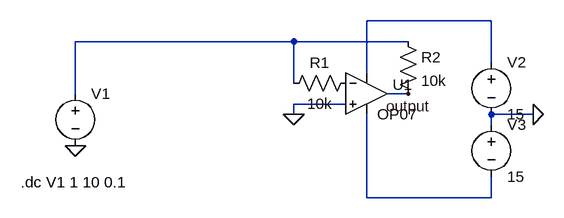
[diagram p0: schematic Draft01.asc]
Draft01.asc, the LTspice schematic file:
Version 4
SHEET 1 880 680
WIRE 608 -16 416 -16
WIRE 304 16 -32 16
WIRE 480 16 304 16
WIRE 608 48 608 -16
WIRE 416 64 416 -16
WIRE 304 80 304 16
WIRE -32 96 -32 16
WIRE 480 96 448 96
WIRE 384 112 304 112
WIRE 304 128 304 112
WIRE 672 128 608 128
WIRE 608 144 608 128
WIRE 416 256 416 128
WIRE 608 256 608 224
WIRE 608 256 416 256
FLAG -32 176 0
FLAG 672 128 0
FLAG 480 96 output
FLAG 304 128 0
SYMBOL voltage -32 80 R0
WINDOW 123 0 0 Left 0
WINDOW 39 0 0 Left 0
SYMATTR InstName V1
SYMATTR Value ""
SYMBOL OpAmps\\OP07 416 32 R0
WINDOW 0 40 50 Left 2
SYMATTR InstName U1
SYMBOL voltage 608 32 R0
WINDOW 123 0 0 Left 0
WINDOW 39 0 0 Left 0
SYMATTR InstName V2
SYMATTR Value 15
SYMBOL voltage 608 128 R0
WINDOW 123 0 0 Left 0
WINDOW 39 0 0 Left 0
SYMATTR InstName V3
SYMATTR Value 15
SYMBOL res 400 64 R90
WINDOW 0 0 56 VBottom 2
WINDOW 3 32 56 VTop 2
SYMATTR InstName R1
SYMATTR Value 10k
SYMBOL res 464 0 R0
SYMATTR InstName R2
SYMATTR Value 10k
TEXT -116 232 Left 2 !.dc V1 1 10 0.1

The netlist it stands for:
* Draft01.asc
V1 N002 0
XU1 0 P001 N001 N003 output LT1001  ; OP07, pins In+ In- V+ V- OUT
V2 N001 0 15
V3 0 N003 15
R1 P001 N002 10k
R2 N002 output 10k
.dc V1 1 10 0.1
.lib LTC.lib
.backanno
.end